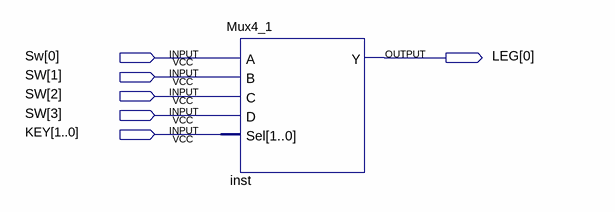
[diagram p0: schematic sheet]
// Quartus schematic Mux4_1Demo.bdf as structural Verilog: 1 symbols, 6 pins
module Mux4_1Demo (
  input  [3:0] Sw,
  input  [1:0] KEY,
  output [0:0] LEG
);

  Mux4_1 inst (.A(Sw[0]), .B(Sw[1]), .C(Sw[2]), .D(Sw[3]), .Sel(KEY), .Y(LEG[0]));
endmodule
